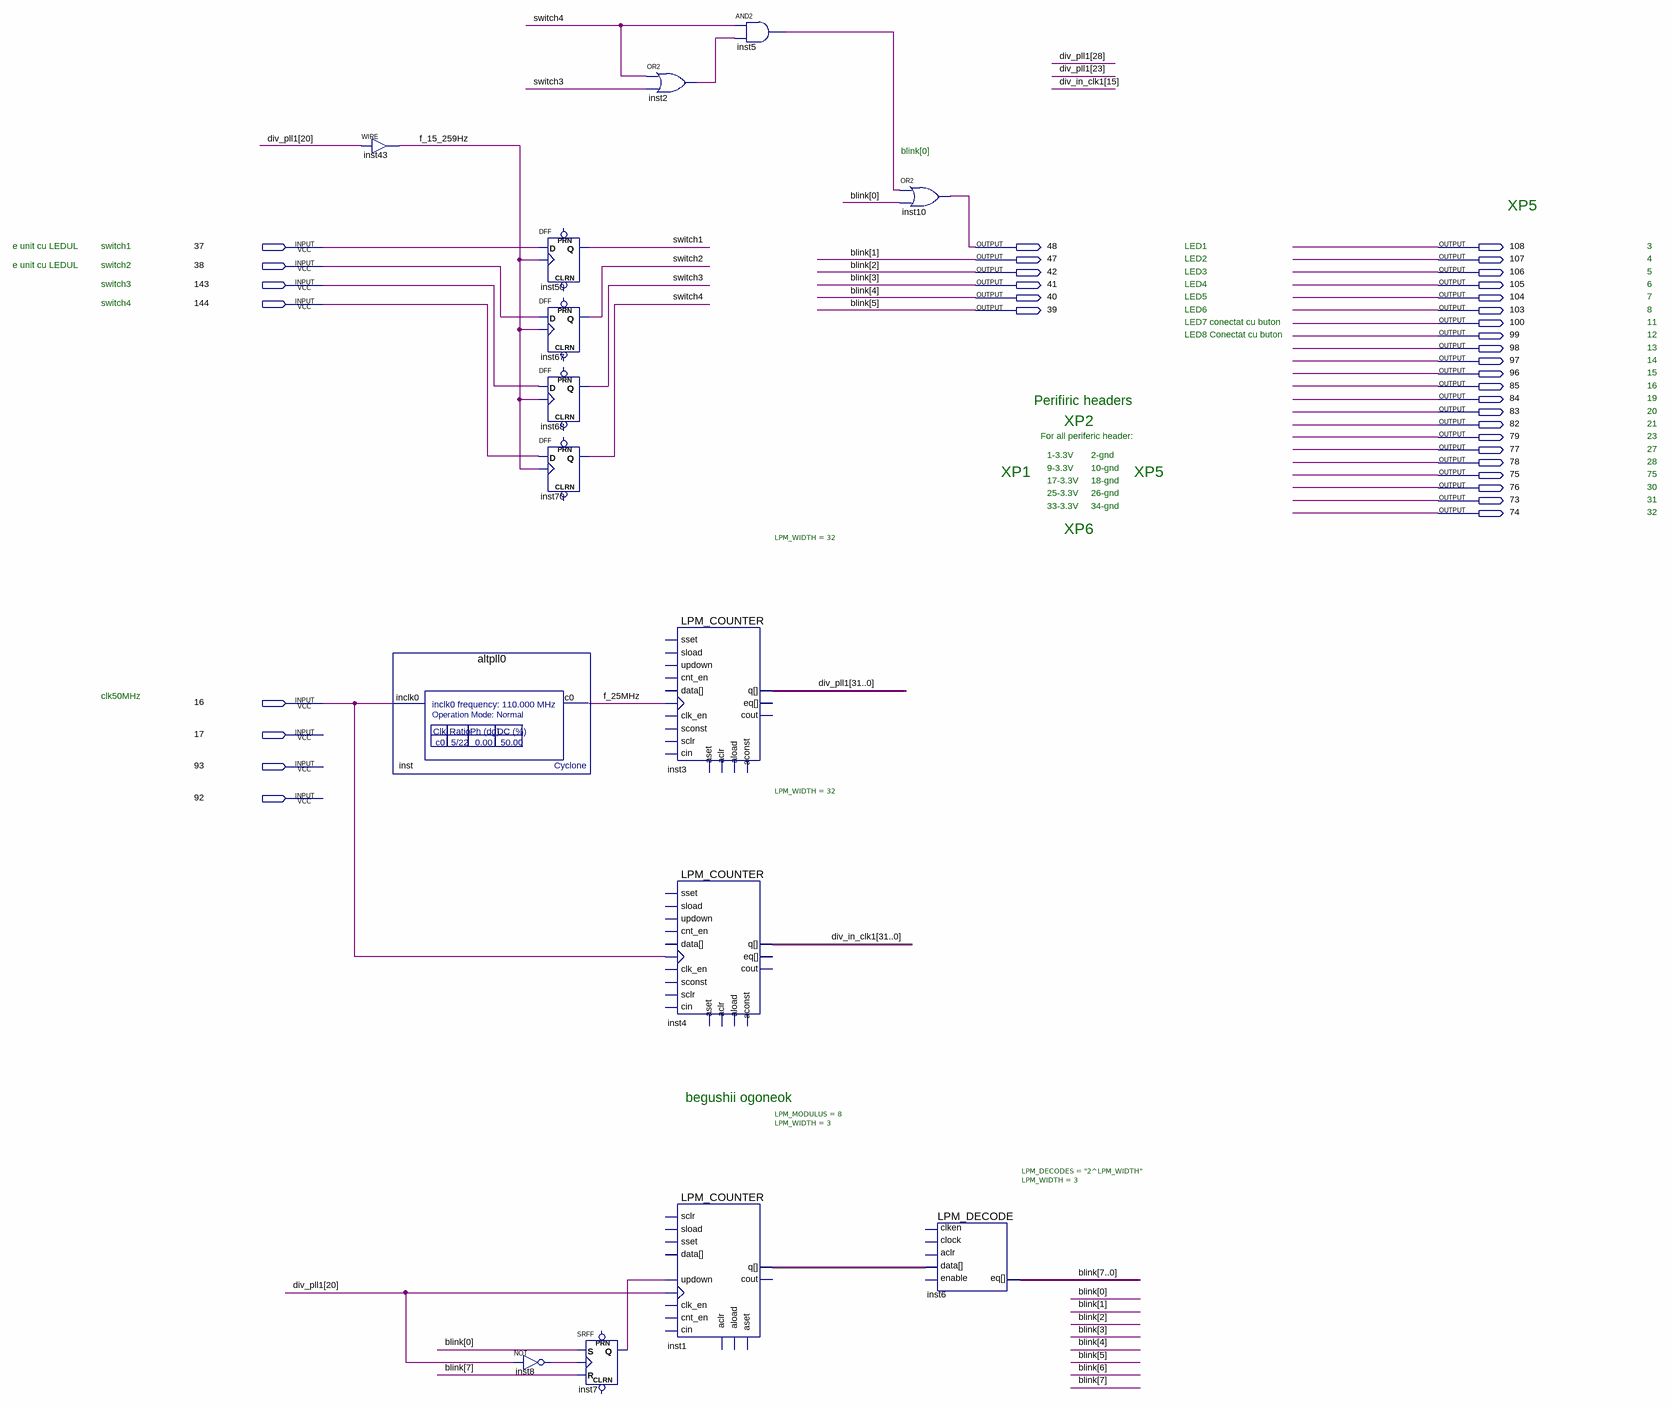
[diagram p0: schematic sheet]
// Quartus schematic Qua_BRD_EP1C6T144I7.bdf as structural Verilog: 15 symbols, 36 pins
module Qua_BRD_EP1C6T144I7 (
  input  \37 ,
  input  \38 ,
  input  \143 ,
  input  \144 ,
  input  \16 ,
  input  \17 ,
  input  \93 ,
  input  \92 ,
  output \48 ,
  output \108 ,
  output \47 ,
  output \107 ,
  output \42 ,
  output \106 ,
  output \41 ,
  output \105 ,
  output \40 ,
  output \104 ,
  output \39 ,
  output \103 ,
  output \100 ,
  output \99 ,
  output \98 ,
  output \97 ,
  output \96 ,
  output \85 ,
  output \84 ,
  output \83 ,
  output \82 ,
  output \79 ,
  output \77 ,
  output \78 ,
  output \75 ,
  output \76 ,
  output \73 ,
  output \74 
);

  wire f_15_259Hz, f_25MHz, inst2_out, inst5_out, inst7_q, inst8_out, switch1, switch2, switch3, switch4;
  wire [2:0] inst1_q;
  wire [7:0] blink;
  wire [31:0] div_in_clk1, div_pll1;

  assign f_15_259Hz = div_pll1[20];  // WIRE inst43
  altpll0 inst (.inclk0(\16 ), .c0(f_25MHz));
  not inst8 (inst8_out, div_pll1[20]);
  DFF inst50 (.CLK(f_15_259Hz), .D(\37 ), .Q(switch1));  // open: CLRN, PRN
  DFF inst67 (.CLK(f_15_259Hz), .D(\38 ), .Q(switch2));  // open: CLRN, PRN
  DFF inst68 (.CLK(f_15_259Hz), .D(\143 ), .Q(switch3));  // open: CLRN, PRN
  DFF inst70 (.CLK(f_15_259Hz), .D(\144 ), .Q(switch4));  // open: CLRN, PRN
  SRFF inst7 (.S(blink[0]), .R(blink[7]), .CLK(inst8_out), .Q(inst7_q));  // open: PRN, CLRN
  or inst2 (inst2_out, switch4, switch3);
  LPM_COUNTER #(.LPM_WIDTH(32)) inst3 (
    .clock(f_25MHz), .q(div_pll1));  // open: sset, sload, updown, cnt_en, data, clk_en, sconst, sclr, aload, aclr, aset, aconst, cin, eq, cout
  LPM_COUNTER #(.LPM_WIDTH(32)) inst4 (
    .clock(\16 ), .q(div_in_clk1));  // open: sset, sload, updown, cnt_en, data, clk_en, sconst, sclr, aload, aclr, aset, aconst, cin, eq, cout
  LPM_COUNTER #(.LPM_MODULUS(8), .LPM_WIDTH(3)) inst1 (
    .clock(div_pll1[20]), .updown(inst7_q), .q(inst1_q));  // open: sload, data, clk_en, aload, aclr, aset, cin, sset, cnt_en, sclr, cout
  and inst5 (inst5_out, switch4, inst2_out);
  or inst10 (\48 , inst5_out, blink[0]);
  LPM_DECODE #(.LPM_DECODES("2^LPM_WIDTH"), .LPM_WIDTH(3)) inst6 (
    .data(inst1_q), .eq({blink[7:6], \39 , \40 , \41 , \42 , \47 , blink[0]}));  // open: enable, clken, clock, aclr

  // Other names for the same wires on the sheet: blink[5:1] = {\39 , \40 , \41 , \42 , \47 }

  // Notes on the sheet:
  //   blink[0]
  //   XP5
  //   e unit cu LEDUL
  //   switch1
  //   LED1
  //   3
  //   LED2
  //   4
  //   e unit cu LEDUL
  //   switch2
  //   LED3
  //   5
  //   switch3
  //   LED4
  //   6
  //   LED5
  //   7
  //   switch4
  //   LED6
  //   8
  //   LED7 conectat cu buton
  //   11
  //   LED8 Conectat cu buton
  //   12
  //   13
  //   14
  //   15
  //   16
  //   Perifiric headers
  //   19
  //   20
  //   XP2
  //   21
  //   For all periferic header:
  //   23
  //   27
  //   1-3.3V
  //   2-gnd
  //   28
  //   XP1
  //   9-3.3V
  //   10-gnd
  //   XP5
  //   75
  //   17-3.3V
  //   18-gnd
  //   30
  //   25-3.3V
  //   26-gnd
  //   31
  //   33-3.3V
  //   34-gnd
  //   32
  //   XP6
  //   clk50MHz
  //   begushii ogoneok
endmodule
